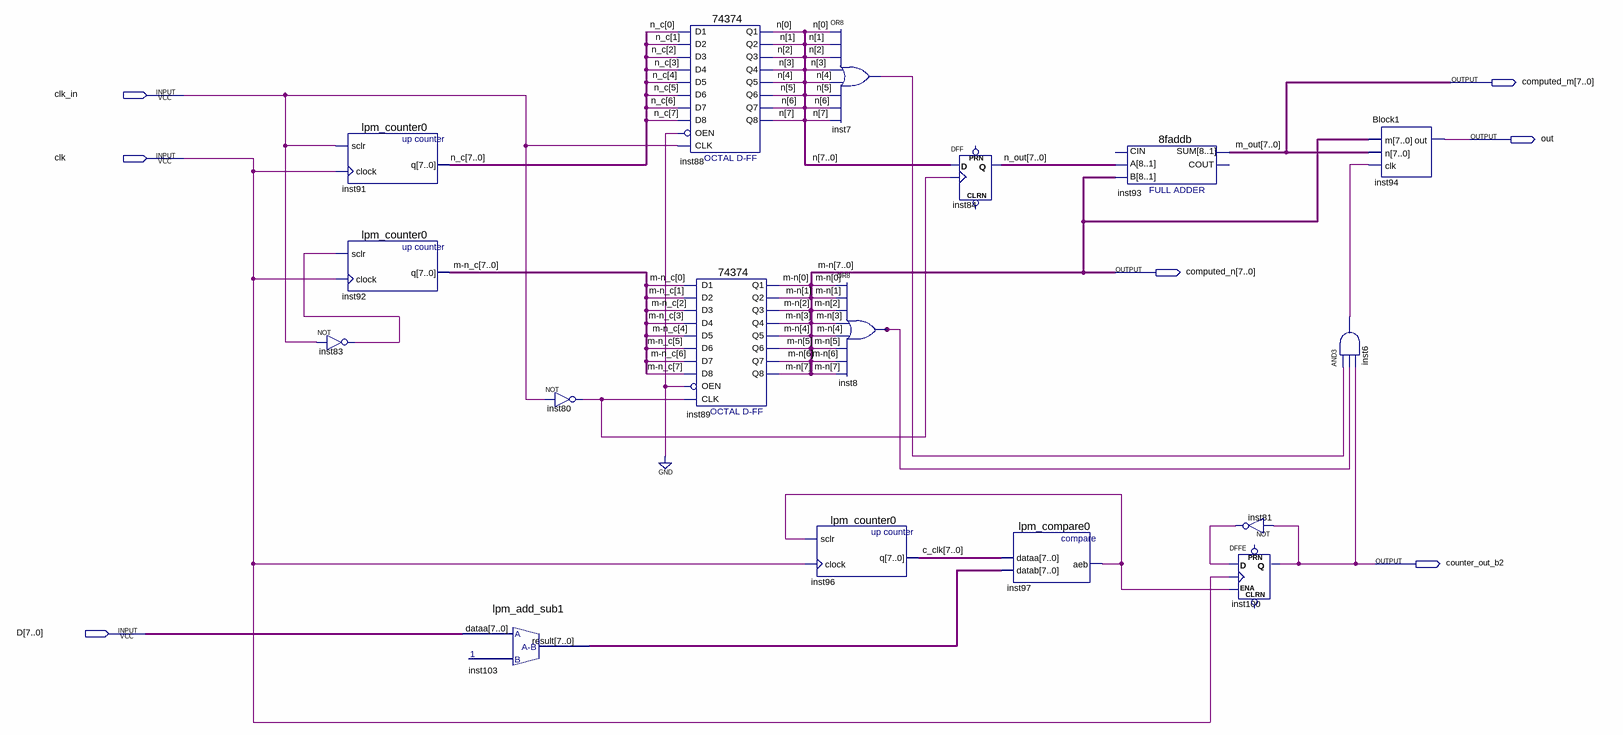
[diagram p0: schematic sheet]
// Quartus schematic Block2.bdf as structural Verilog: 17 symbols, 7 pins
module Block2 (
  input  clk_in,
  input  clk,
  input  [7:0] D,
  output [7:0] computed_m,
  output out,
  output [7:0] computed_n,
  output counter_out_b2
);

  wire inst6_out, inst7_out, inst8_out, inst80_out, inst81_out, inst83_out, inst97_aeb;
  wire [7:0] c_clk, inst103_result, \m-n_c , n, n_c, n_out;

  lpm_counter0 inst91 (.sclr(clk_in), .clock(clk), .q(n_c));
  lpm_counter0 inst92 (.sclr(inst83_out), .clock(clk), .q(\m-n_c ));
  not inst83 (inst83_out, clk_in);
  lpm_add_sub1 inst103 (.dataa(D), .result(inst103_result));
  not inst80 (inst80_out, clk_in);
  \74374  inst88 (
    .D1(n_c[0]), .D2(n_c[1]), .D3(n_c[2]), .D4(n_c[3]), .D6(n_c[5]), .D5(n_c[4]), .OEN(1'b0), .D8(n_c[7]),
    .D7(n_c[6]), .CLK(clk_in), .Q2(n[1]), .Q3(n[2]), .Q5(n[4]), .Q4(n[3]), .Q6(n[5]), .Q7(n[6]), .Q8(n[7]),
    .Q1(n[0]));
  \74374  inst89 (
    .D1(\m-n_c [0]), .D2(\m-n_c [1]), .D3(\m-n_c [2]), .D4(\m-n_c [3]), .D6(\m-n_c [5]), .D5(\m-n_c [4]),
    .OEN(1'b0), .D8(\m-n_c [7]), .D7(\m-n_c [6]), .CLK(inst80_out), .Q2(computed_n[1]), .Q3(computed_n[2]),
    .Q5(computed_n[4]), .Q4(computed_n[3]), .Q6(computed_n[5]), .Q7(computed_n[6]), .Q8(computed_n[7]),
    .Q1(computed_n[0]));
  lpm_counter0 inst96 (.sclr(inst97_aeb), .clock(clk), .q(c_clk));
  or inst7 (inst7_out, n[0], n[1], n[2], n[3], n[4], n[5], n[6], n[7]);
  or inst8 (inst8_out, computed_n[0], computed_n[1], computed_n[2], computed_n[3], computed_n[4], computed_n[5], computed_n[6], computed_n[7]);
  DFF inst84[7:0] (.CLK(inst80_out), .D(n), .Q(n_out));  // open: CLRN, PRN
  lpm_compare0 inst97 (.dataa(c_clk), .datab(inst103_result), .aeb(inst97_aeb));
  \8faddb  inst93 (.A(n_out), .B(computed_n), .SUM(computed_m));  // open: CIN, COUT
  not inst81 (inst81_out, counter_out_b2);
  DFFE inst100 (.D(inst81_out), .CLK(clk), .ENA(inst97_aeb), .Q(counter_out_b2));  // open: PRN, CLRN
  Block1 inst94 (.m(computed_n), .n(computed_m), .clk(inst6_out), .out(out));
  and inst6 (inst6_out, inst7_out, inst8_out, counter_out_b2);

  // Other names for the same wires on the sheet: m-n[7:0] = computed_n; m_out[7:0] = computed_m
endmodule
